# Altium schematic sheet DAC_SET1.SchDoc
size A4; SheetNumber: 2; SheetTotal: 4
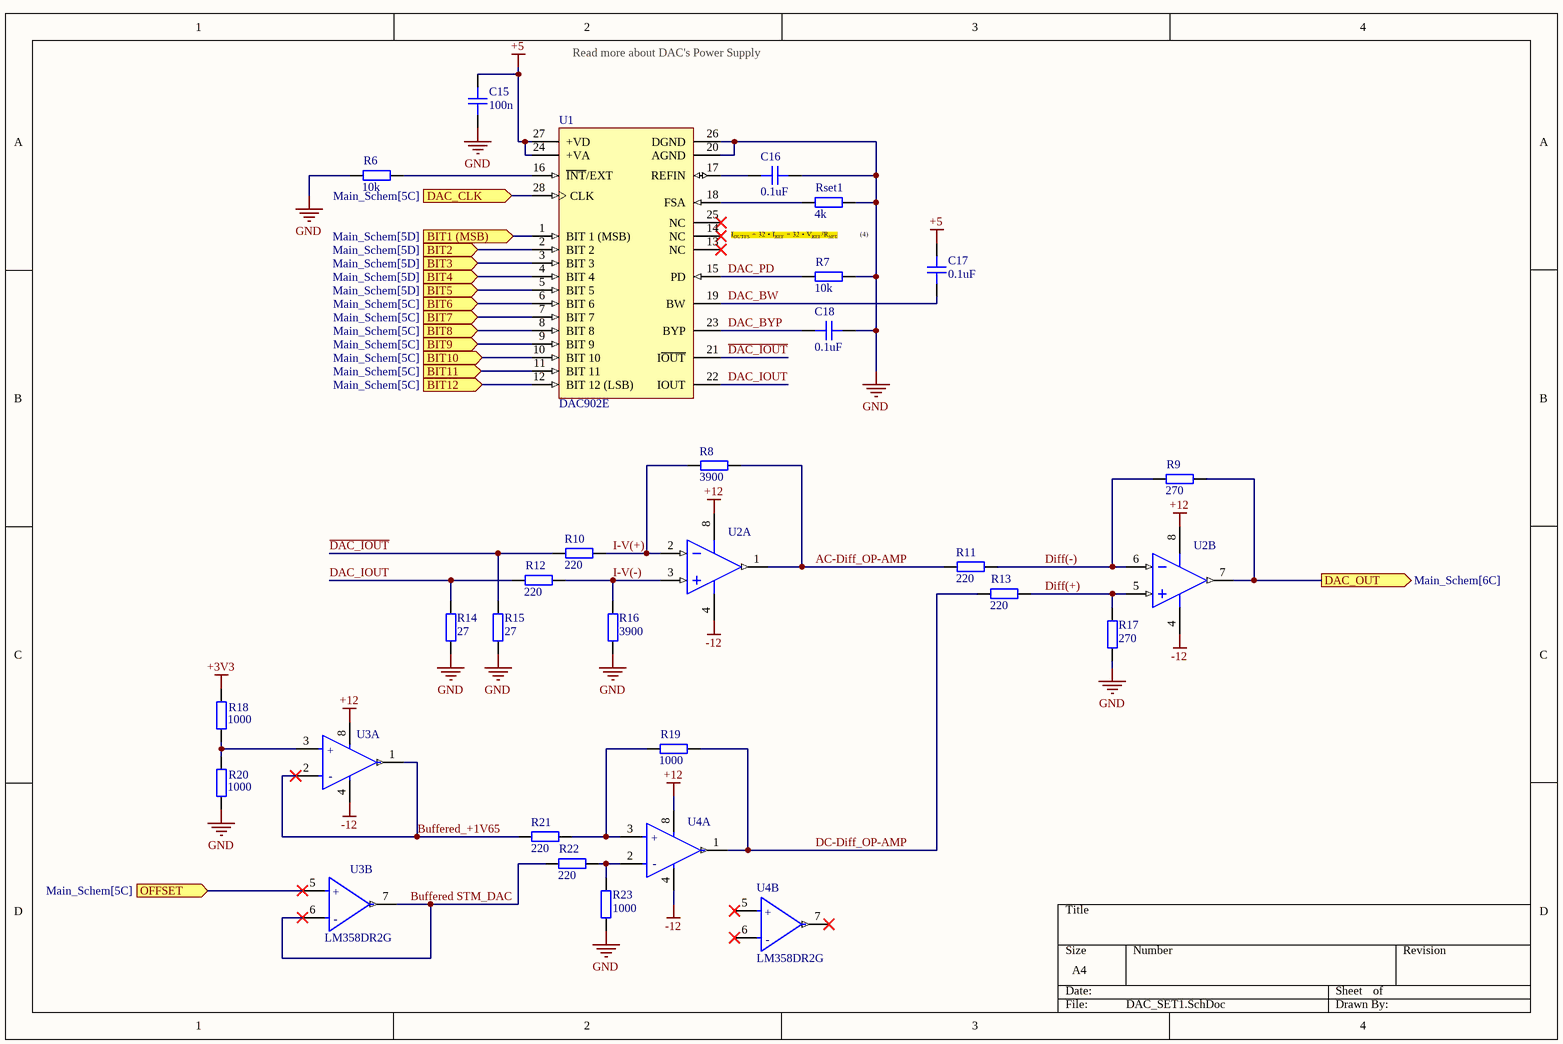
[diagram p0: DAC_SET1.SchDoc]

## Parts
C15  100n  [CAP_0805]
C16  0.1uF  [CAP_1210]
C17  0.1uF  [CAP_1210]
C18  0.1uF  [CAP_1210]
R6  10k  [RES_0805]
R7  10k  [RES_0805]
R8  3900  [RES_0805]
R9  270  [RES_0805]
R10  220  [RES_0805]
R11  220  [RES_0805]
R12  220  [RES_0805]
R13  220  [RES_0805]
R14  27  [RES_0805]
R15  27  [RES_0805]
R16  3900  [RES_0805]
R17  270  [RES_0805]
R18  1000  [RES_0805]
R19  1000  [RES_0805]
R20  1000  [RES_0805]
R21  220  [RES_0805]
R22  220  [RES_0805]
R23  1000  [RES_0805]
Rset1  4k  [RES_0805]
U1  DAC902E  [TI-PW28_L]
U2  AD8066ARZ-R7  [ADI-R-8_M]  (value not drawn)  (parts A,B of 2)
U3  LM358DR2G  [FP-751-07-IPC_C]  (value not drawn)  (parts A,B of 2)
U4  LM358DR2G  [FP-751-07-IPC_C]  (value not drawn)  (parts A,B of 2)

## Ports
BIT1 (MSB) (in, see Main_Schem[5D]), BIT2 (in, see Main_Schem[5D]), BIT3 (in, see Main_Schem[5D]), BIT4 (in, see Main_Schem[5D]), BIT5 (in, see Main_Schem[5D]), BIT6 (in, see Main_Schem[5C]), BIT7 (in, see Main_Schem[5C]), BIT8 (in, see Main_Schem[5C]), BIT9 (in, see Main_Schem[5C]), BIT10 (in, see Main_Schem[5C]), BIT11 (in, see Main_Schem[5C]), BIT12 (in, see Main_Schem[5C]), DAC_CLK (in, see Main_Schem[5C]), DAC_OUT (out, see Main_Schem[6C]), OFFSET (in, see Main_Schem[5C])

## Nets
+3V3: R18.1
+5: C15.2 C17.2 U1.24(+VA) U1.27(+VD)
+12: U2.8(+VS) U3.8(VCC) U4.8(VCC)
-12: U2.4(-VS) U3.4(VEE/GND) U4.4(VEE/GND)
GND: C15.1 C16.2 C18.2 R6.2 R7.1 R14.2 R15.2 R16.2 R17.2 R20.2 R23.2 Rset1.1 U1.20(AGND) U1.26(DGND)
~{DAC_IOUT}: R10.2 R15.1 U1.21(I~{OUT})
AC-Diff_OP-AMP: R8.2 R11.2 U2.1(VOUT_1)
BIT1 (MSB): U1.1(BIT_1_(MSB)) ; port BIT1 (MSB)
BIT2: U1.2(BIT_2) ; port BIT2
BIT3: U1.3(BIT_3) ; port BIT3
BIT4: U1.4(BIT_4) ; port BIT4
BIT5: U1.5(BIT_5) ; port BIT5
BIT6: U1.6(BIT_6) ; port BIT6
BIT7: U1.7(BIT_7) ; port BIT7
BIT8: U1.8(BIT_8) ; port BIT8
BIT9: U1.9(BIT_9) ; port BIT9
BIT10: U1.10(BIT_10) ; port BIT10
BIT11: U1.11(BIT_11) ; port BIT11
BIT12: U1.12(BIT_12_(LSB)) ; port BIT12
Buffered STM_DAC: R22.2 U3.6(INPUT_B-) U3.7(OUTPUT_B)
Buffered_+1V65: R21.2 U3.1(OUTPUT_A) U3.2(INPUT_A-)
DAC_BW: C17.1 U1.19(BW)
DAC_BYP: C18.1 U1.23(BYP)
DAC_CLK: U1.28(CLK) ; port DAC_CLK
DAC_IOUT: R12.2 R14.1 U1.22(IOUT)
DAC_OUT: R9.1 U2.7(VOUT_2) ; port DAC_OUT
DAC_PD: R7.2 U1.15(PD)
DC-Diff_OP-AMP: R13.2 R19.1 U4.1(OUTPUT_A)
Diff(+): R13.1 R17.1 U2.5(+IN_2)
Diff(-): R9.2 R11.1 U2.6(-IN_2)
I-V(+): R8.1 R10.1 U2.2(-IN_1)
I-V(-): R12.1 R16.1 U2.3(+IN_1)
OFFSET: U3.5(INPUT_B+) ; port OFFSET
NetC16_1: C16.1 U1.17(REFIN)
NetR6_1: R6.1 U1.16(~{INT}/EXT)
NetR18_2: R18.2 R20.1 U3.3(INPUT_A+)
NetR19_2: R19.2 R21.1 U4.3(INPUT_A+)
NetR22_1: R22.1 R23.1 U4.2(INPUT_A-)
NetRset1_2: Rset1.2 U1.18(FSA)

Not connected (* = marked no-connect by the designer): U1 13(NC)* 14(NC)* 25(NC)*; U4 5(INPUT_B+)* 6(INPUT_B-)* 7(OUTPUT_B)*

## Notes on the sheet
- Read more about DAC's Power Supply
- (in symbol CMP-1310-00291-2, part A) +; -
- (in symbol CMP-1310-00291-2, part B) +; -

## Library data of the parts
C15 = CAP_0805: Capacitor SMD 0805; Manufacturer: *; Manufacturer Part Number: *; Distributor Link: *; LCSC: *; Rating: *; Dielectric: *
C16-C18 = CAP_1210: Capacitor SMD 1210; Manufacturer: *; Manufacturer Part Number: *; Distributor Link: *; LCSC: *; Rating: *; Dielectric: *
R6-R23 Rset1 = RES_0805: Resistor SMD 0805; Manufacturer: *; Manufacturer Part Number: *; Distributor Link: *; LCSC: *
U1 = CMP-0004-01382-1: 12-Bit, 165 MSPS SpeedPlus(TM) DAC Scalable Current Outputs between 2 to 20 mA, -40 to 85 degC, 28-pin SOP (PW28), Green (RoHS & no Sb/Br); Manufacturer: Texas Instruments; Settling Time(us): 0.03; Power Consumption(Typ)(mW): 170; SFDR(dB): 75; DNL(Max)(+/-LSB): 1.75; INL(Max)(+/-LSB): 2.5; Resolution(Bits): 12; Interface: Parallel CMOS; DAC Channels: 1; SubFamily: High Speed DAC (>10MSPS); ComponentLink3Description: Package Specification; ComponentLink2Description: Datasheet; Code_JEDEC: MO-153; Eco-Plan: Green (RoHS & no Sb/Br); Mounting Technology: Surface Mount; ComponentLink1URL: http://www.ti.com/; PackageDescription: 28-Pin Plastic Small Outline, Body 9.7 x 4.4 mm, Pitch 0.65 mm; PackageVersion: 4040064-7/G, 02/2011; ComponentLink1Description: Manufacturer URL; DatasheetVersion: SBAS094B; ComponentLink3URL: http://www.ti.com/litv/pdf/mpds364; ComponentLink2URL: http://www.ti.com/general/docs/lit/getliterature.tsp?genericPartNumber=DAC902&fileType=pdf; PackageReference: PW28; PartNumber: DAC902E
U2 = CMP-0384-01346-2: Double Channel Low Power Operational Amplifier, 145 MHz BW, 180 V/us SR, Industrial, 8-pin SOIC (R-8), Reel; Manufacturer: Analog Devices; Generic Part Number: AD8066; Small Signal Bandwidth: 145MHz; V Span Min: 5V; Input Offset Voltage: 400uV; V Span Max: 24V; Input Bias Current: 2pA; Amplifiers Per Package: 2; Iq/Amp: 7.4mA; ComponentLink1URL: http://www.analog.com/en/index.html; ComponentLink4Description: Reference Circuit; ComponentLink3URL: http://www.analog.com/static/imported-files/packages/PKG_PDF/SOIC_Narrow%20(R)/R_8.pdf; Code_JEDEC: MS-012-AA; ComponentLink3Description: Package Specification; ComponentLink4URL: http://www.analog.com/en/all-operational-amplifiers-op-amps/operational-amplifiers-op-amps/ad8066/products/product.html#product-recommendations; RevisionNote: Reference Circuit URL fixed; ComponentLink1Description: Manufacturer URL; PackageDescription: 8-Pin Standard Small Outline Package, Body 3.9 x 4.9 mm, Pitch 1.27 mm; PackageReference: R-8; Slew Rate: 180V/us; PackageVersion: 060506-A; Mounting Technology: Surface Mount; ComponentLink2Description: Datasheet; ComponentLink2URL: http://www.analog.com/static/imported-files/data_sheets/AD8065_8066.pdf; PartNumber: AD8066ARZ-R7; DatasheetVersion: Rev. J
U3 U4 = CMP-1310-00291-2: IC OPAMP GP 2 CIRCUIT 8SOIC; Gain Bandwidth Product: 1MHz; Number of Circuits: 2; Min Supply Voltage: 3V; Slew Rate: 0.6V/µs; Max Dual Supply Voltage: 16V; Common Mode Rejection Ratio: 65dB; Input Bias Current: 250nA; Min Dual Supply Voltage: 1.5V; Dual Supply Voltage: 9V; Operating Supply Current: 1.5mA; Output Current: 40mA; Input Offset Voltage (Vos): 7mV; Nominal Supply Current: 1.2mA; Voltage Gain: 100dB; Max Supply Voltage: 32V; Width: 4mm; Number of Pins: 8; Min Operating Temperature: 0°C; REACH SVHC: No SVHC; Contact Plating: Tin; Lead Free: Lead Free; Halogen Free: Halogen Free; Power Supply Rejection Ratio (PSRR): 65dB; Operating Supply Voltage: 16V; Package Quantity: 2500; Max Operating Temperature: 70°C; Case/Package: SOIC; Height: 1.5mm; Packaging: Tape and Reel; Radiation Hardening: No; Number of Channels: 2; Bandwidth: 1MHz; Length: 5mm; Number of Elements: 2; Number of Amplifiers: 2; Output Current per Channel: 40mA